# Altium schematic sheet PCB_01.SchDoc
size A
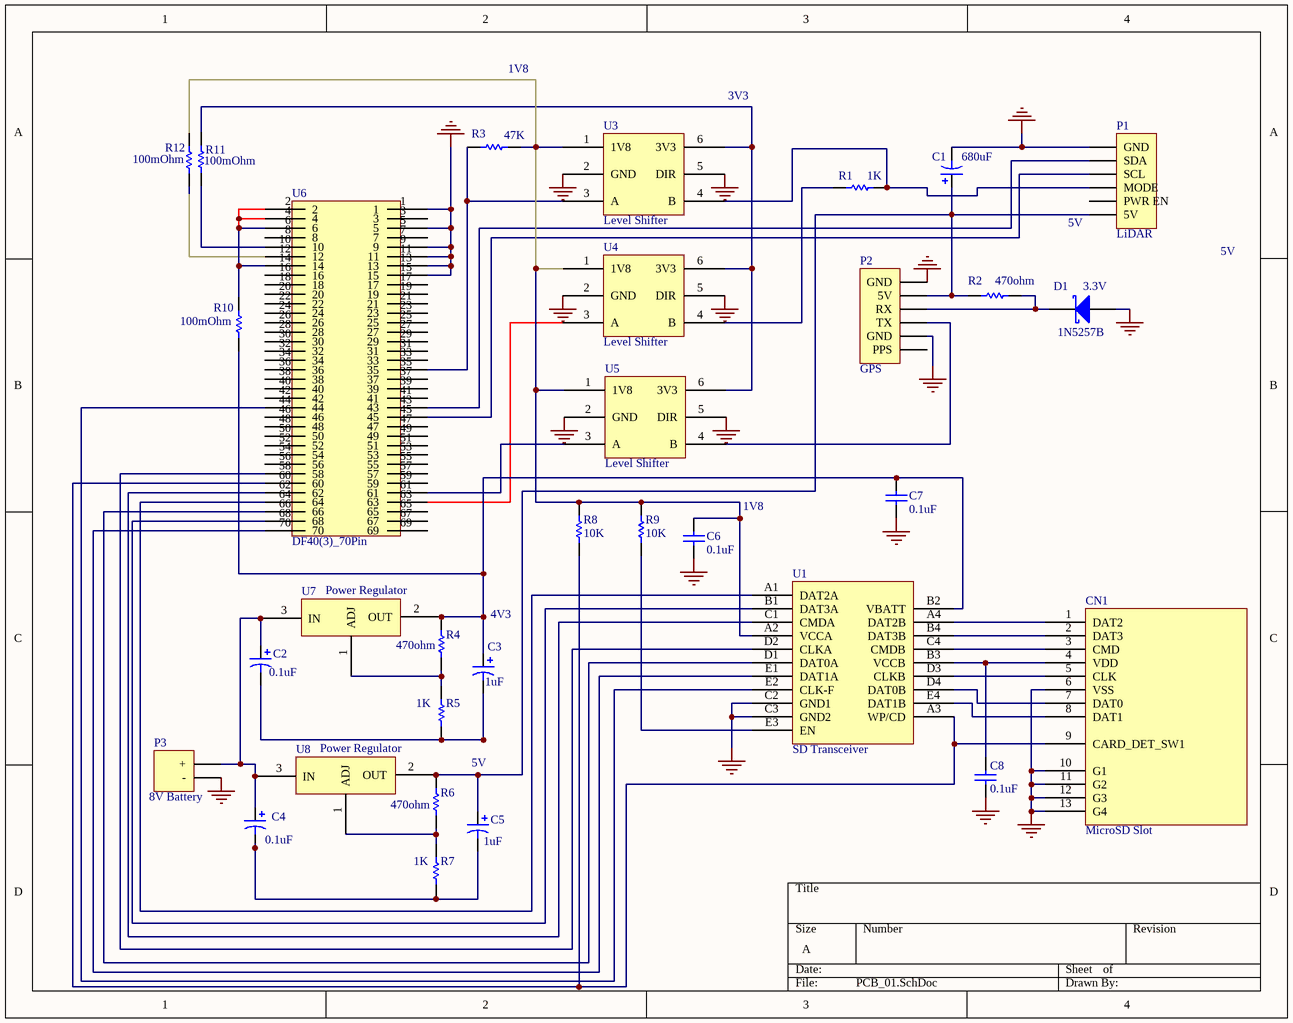
[diagram p0: PCB_01.SchDoc]

## Parts
C1  value 680uF  [RB7.6-15]  (hidden comment: Cap Pol1)
C2  value 0.1uF  [RB7.6-15]  (hidden comment: Cap Pol1)
C3  value 1uF  [RB7.6-15]  (hidden comment: Cap Pol1)
C4  value 0.1uF  [RB7.6-15]  (hidden comment: Cap Pol1)
C5  value 1uF  [RB7.6-15]  (hidden comment: Cap Pol1)
C6  value 0.1uF  [RAD-0.3]  (hidden comment: Cap)
C7  value 0.1uF  [RAD-0.3]  (hidden comment: Cap)
C8  value 0.1uF  [RAD-0.3]  (hidden comment: Cap)
CN1  MicroSD Slot  [MICROSD Slot]
D1_3.3V  1N5257B  [TO-220AC]
P1  LiDAR  [HDR1X6]
P2  GPS  [HDR1X6]
P3  8V Battery  [HDR1X2]
R1  value 1K  [AXIAL-0.3]  (hidden comment: Res1)
R2  value 470ohm  [AXIAL-0.3]  (hidden comment: Res1)
R3  value 47K  [AXIAL-0.3]  (hidden comment: Res1)
R4  value 470ohm  [AXIAL-0.3]  (hidden comment: Res1)
R5  value 1K  [AXIAL-0.3]  (hidden comment: Res1)
R6  value 470ohm  [AXIAL-0.3]  (hidden comment: Res1)
R7  value 1K  [AXIAL-0.3]  (hidden comment: Res1)
R8  value 10K  [AXIAL-0.3]  (hidden comment: Res1)
R9  value 10K  [AXIAL-0.3]  (hidden comment: Res1)
R10  value 100mOhm  [AXIAL-0.3]  (hidden comment: Res1)
R11  value 100mOhm  [AXIAL-0.3]  (hidden comment: Res1)
R12  value 100mOhm  [AXIAL-0.3]  (hidden comment: Res1)
U1  SD Transceiver  [TXS0206-29_Dia Reduce]
U3  Level Shifter  [74LVC1T45]
U4  Level Shifter  [74LVC1T45]
U5  Level Shifter  [74LVC1T45]
U6  DF40(3)_70Pin  [DF40(3)_70Pin]
U7  Power Regulator  [LM317LCPK]
U8  Power Regulator  [LM317LCPK]

## Nets
GND: C6.1 C7.1 C8.1 CN1.6(VSS) CN1.10(G1) CN1.11(G2) CN1.12(G3) CN1.13(G4) P3.1(-) U1.C2(GND1) U1.C3(GND2) U3.2(GND) U3.5(DIR) U4.2(GND) U4.5(DIR) U5.2(GND) U5.5(DIR) U6.1 U6.5 U6.9 U6.11 U6.13 U6.15
NetC1_2: C1.2 D1_3.3V.3(A) P1.1(GND) P2.2(GND) P2.6(GND)
NetC1_1: C1.1 C5.1 P1.6(5V) P2.5(5V) R2.1 R6.1 U8.2(OUT)
NetC2_1: C2.1 C4.1 P3.2(+) U7.3(IN) U8.3(IN)
NetC2_2: C2.2 C3.2 R5.2
NetC3_1: C3.1 C7.2 R4.1 R10.1 U1.B2(VBATT) U7.2(OUT)
NetC4_2: C4.2 C5.2 R7.2
NetC6_2: C6.2 R3.2 R8.2 R9.2 R12.2 U1.A2(VCCA) U3.1(1V8) U4.1(1V8) U5.1(1V8)
NetC8_2: C8.2 CN1.4(VDD) U1.B3(VCCB)
NetCN1_1: CN1.1(DAT2) U1.A4(DAT2B)
NetCN1_2: CN1.2(DAT3) U1.B4(DAT3B)
NetCN1_3: CN1.3(CMD) U1.C4(CMDB)
NetCN1_5: CN1.5(CLK) U1.D3(CLKB)
NetCN1_7: CN1.7(DAT0) U1.D4(DAT0B)
NetCN1_8: CN1.8(DAT1) U1.E4(DAT1B)
NetCN1_9: CN1.9(CARD_DET_SW1) R8.1 U1.A3(WP/CD) U6.60
NetD1_3.3V_1: D1_3.3V.1(K) P2.4(RX) R2.2
NetP1_2: P1.2(SDA) U6.43
NetP1_3: P1.3(SCL) U6.45
NetP1_4: P1.4(MODE) R1.2 U3.4(B)
NetP2_3: P2.3(TX) U5.4(B)
NetR1_1: R1.1 U4.4(B)
NetR3_1: R3.1 U3.3(A) U6.35
NetR4_2: R4.2 R5.1 U7.1(ADJ)
NetR6_2: R6.2 R7.1 U8.1(ADJ)
NetR9_1: R9.1 U1.E3(EN)
NetR10_2: R10.2 U6.2 U6.4 U6.6 U6.14
NetR11_1: R11.1 U6.10
NetR12_1: R12.1 U6.12
NetU1_A1: U1.A1(DAT2A) U6.64
NetU1_B1: U1.B1(DAT3A) U6.68
NetU1_C1: U1.C1(CMDA) U6.62
NetU1_D1: U1.D1(DAT0A) U6.66
NetU1_D2: U1.D2(CLKA) U6.58
NetU1_E1: U1.E1(DAT1A) U6.70
NetU1_E2: U1.E2(CLK-F) U6.44
NetU3_6: U3.6(3V3) U4.6(3V3) U5.6(3V3)
NetU4_3: U4.3(A) U6.63
NetU5_3: U5.3(A) U6.61

Not connected (* = marked no-connect by the designer): P1 5(PWR_EN); P2 1(PPS); R11 2; U6 3 7 8 16 17 18 19 20 21 22 23 24 25 26 27 28 29 30 31 32 33 34 36 37 38 39 40 41 42 46 47 48 49 50 51 52 53 54 55 56 57 59 65 67 69

## Notes on the sheet
- 1V8
- 3V3
- (near P1) 5V
- 5V
- 4V3

## Library data of the parts
C1-C5 = Cap Pol1: Polarized Capacitor (Radial); Published: 8-Jun-2000; LatestRevisionDate: 17-Jul-2002; LatestRevisionNote: Re-released for DXP Platform.; PackageReference: RB7.6-15; Publisher: Altium Limited; PackageDescription: Polarized Capacitor (Radial); 2 Leads
C6-C8 = Cap: Capacitor; Published: 8-Jun-2000; LatestRevisionDate: 17-Jul-2002; LatestRevisionNote: Re-released for DXP Platform.; PackageReference: RAD-0.3; Publisher: Altium Limited; PackageDescription: Radial Cap, Thru-Hole; 2 Leads; 0.3 in Pin Spacing
D1_3.3V = Diode 10TQ040: Schottky Rectifier; Note: Terminal 2 is the TAB and is electrically connected to the cathode; Published: 8-Jun-2000; LatestRevisionDate: 17-Jul-2002; LatestRevisionNote: Re-released for DXP Platform.; DatasheetVersion: PD-2.057B; PackageVersion: Feb-1998; PackageReference: TO-220AC; Publisher: Altium Limited; PackageDescription: TO, Thru-Hole, Vertical, Heatsink Mounted; 3 In-Line Leads (1 Absent); Pitch 2.54 mm; ComponentLink1Description: Manufacturer Link; ComponentLink1URL: http://www.irf.com/
P1 = Header 6: Header, 6-Pin, for LiDAR; LatestRevisionDate: 17-Jul-2002; LatestRevisionNote: Re-released for DXP Platform.; Publisher: Altium Limited
P2 = Header 6: Header, 6-Pin, for GPS; LatestRevisionDate: 17-Jul-2002; LatestRevisionNote: Re-released for DXP Platform.; Publisher: Altium Limited
P3 = Header 2H: Header, 2-Pin, Right Angle; LatestRevisionDate: 17-Jul-2002; LatestRevisionNote: Re-released for DXP Platform.; Publisher: Altium Limited
R1-R12 = Res1: Resistor; Published: 8-Jun-2000; LatestRevisionDate: 17-Jul-2002; LatestRevisionNote: Re-released for DXP Platform.; PackageReference: AXIAL-0.3; Publisher: Altium Limited; PackageDescription: Axial Device, Thru-Hole; 2 Leads; 0.3 in Pin Spacing
U1 = TXS0206-29
U3-U5 = Component_1: 74LVC1T45 Level Shifter